# Altium project Motor_kontrol_Meta_Cekirdek.PrjPcb
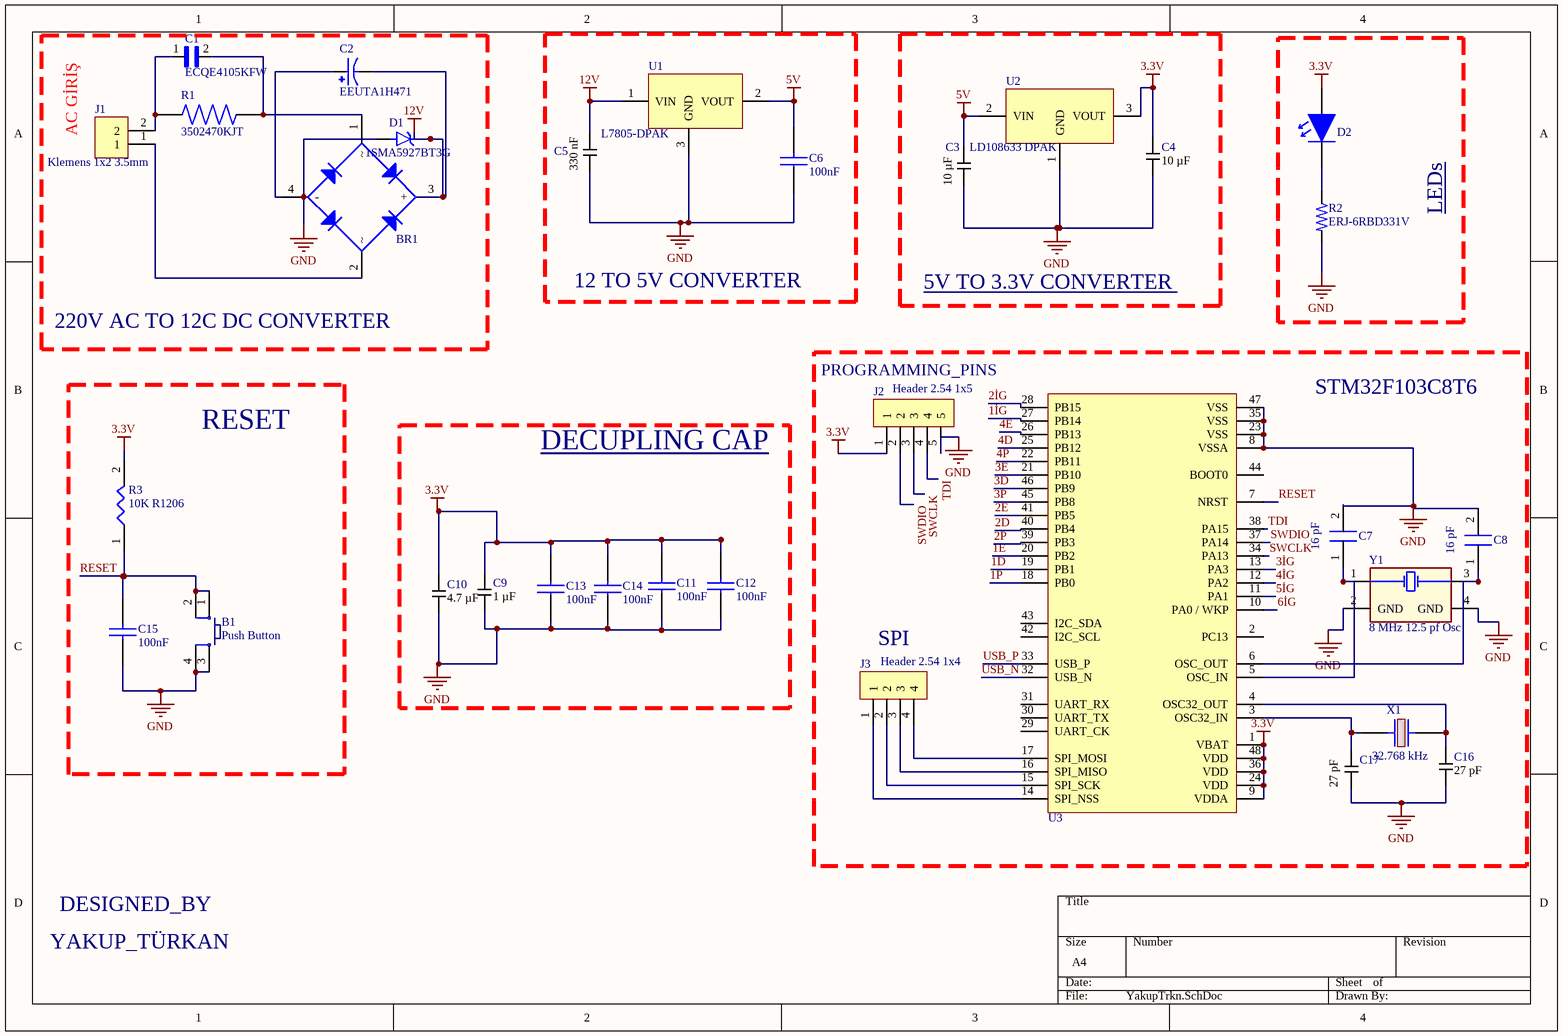
[diagram p0: YakupTrkn.SchDoc]
3 sheets, 70 parts. Net scope: global (net labels, ports and power ports of the same name join across sheets).
Board file: YakupTrkn.PcbDoc
Sheets:
  YakupTrkn.SchDoc
  YakupTrkn(block).SchDoc
  YakupTrkn1.SchDoc

## Sheet YakupTrkn.SchDoc
size A4

### Parts
B1  Push Button  [PUSB BUTTON-SMD]
BR1  DB105STR  [DB105STR]  (value not drawn)
C1  ECQE4105KFW  [CAPRR1500W80L2600T850H2300]
C2  EEUTA1H471  [CAPPRD750W80D1600H2000]
C3  Capacitance: 10 µF  [SAMSUNG_CAP_0805_140]  (hidden comment: CL21B106KPQNNNE)
C4  Capacitance: 10 µF  [SAMSUNG_CAP_0805_140]  (hidden comment: CL21B106KPQNNNE)
C5  Capacitance: 330 nF  [SAMSUNG_CAP_0805_095]  (hidden comment: CL21B334KOCNNNC)
C6  Capacitance: 100nF  [CAP_0603]  (hidden comment: C0603C104K5RACTU)
C7  16 pF  [C1206]
C8  16 pF  [C1206]
C9  Capacitance: 1 µF  [SAMSUNG_CAP_0805_135]  (hidden comment: CL21B105KBFNNNE)
C10  Capacitance: 4.7 µF  [SAMSUNG_CAP_0805_095]  (hidden comment: *)
C11  Capacitance: 100nF  [CAP_0603]  (hidden comment: C0603C104K5RACTU)
C12  Capacitance: 100nF  [CAP_0603]  (hidden comment: C0603C104K5RACTU)
C13  Capacitance: 100nF  [CAP_0603]  (hidden comment: C0603C104K5RACTU)
C14  Capacitance: 100nF  [CAP_0603]  (hidden comment: C0603C104K5RACTU)
C15  Capacitance: 100nF  [CAP_0603]  (hidden comment: C0603C104K5RACTU)
C16  Capacitance: 27 pF  [SAMSUNG_CAP_0805_075]  (hidden comment: CL21C270JBANNNC)
C17  Capacitance: 27 pF  [SAMSUNG_CAP_0805_075]  (hidden comment: CL21C270JBANNNC)
D1  1SMA5927BT3G  [DIOM5226X220N]
D2  LH R974-LP-1  [LED_RED_0805]  (value not drawn)
J1  Klemens 1x2 3.5mm  [Klemens 1x2 - 3.5mm]
J2  Header 2.54 1x5  [Header 2.54 1x5]
J3  Header 2.54 1x4  [Header 2.54 1x4]
R1  3502470KJT  [RESC5025X120N]
R2  ERJ-6RBD331V  [RESC2012X70]
R3  10K R1206  [R1206 Resıstor]
U1  L7805-DPAK  [DPAK228P972X230-3N]
U2  LD108633 DPAK  [DPAK228P972X230-3N]
U3  STM32F103C6T6A  [LQFP-48]  (value not drawn)
X1  Operating Frequency: 32.768 kHz  [ABS05]  (hidden comment: ABS05-32.768KHZ-T)
Y1  8 MHz 12.5 pf Osc  [8 MHZ Osc.]

### Nets
3.3V: C4.1 C9.2 C10.2 C11.2 C12.2 C13.2 C14.2 D2.2 J2.1 R3.2 U2.3(VOUT) U3.1(VBAT) U3.9(VDDA) U3.24(VDD) U3.36(VDD) U3.48(VDD)
5V: C3.2 C6.2 U1.2(VOUT) U2.2(VIN)
12V: BR1.3(+) C2.N C5.2 D1.C U1.1(VIN)
GND: B1.3 B1.4 C3.1 C4.2 C5.1 C6.1 C7.2 C8.2 C9.1 C10.1 C11.1 C12.1 C13.1 C14.1 C15.1 C16.1 C17.2 D1.A J2.5 R2.2 U1.3(GND) U2.1(GND) U3.8(VSSA) U3.23(VSS) U3.35(VSS) U3.47(VSS) Y1.2(GND) Y1.4(GND)
1D: U3.19(PB1)
1E: U3.20(PB2)
1İG: U3.27(PB14)
1P: U3.18(PB0)
2D: U3.40(PB4)
2E: U3.41(PB5)
2İG: U3.28(PB15)
2P: U3.39(PB3)
3D: U3.46(PB9)
3E: U3.21(PB10)
3İG: U3.13(PA3)
3P: U3.45(PB8)
4D: U3.25(PB12)
4E: U3.26(PB13)
4İG: U3.12(PA2)
4P: U3.22(PB11)
5İG: U3.11(PA1)
6İG: U3.10(PA0_/_WKP)
RESET: B1.1 B1.2 C15.2 R3.1 U3.7(NRST)
SWCLK: J2.3 U3.34(PA13)
SWDIO: J2.2 U3.37(PA14)
TDI: J2.4 U3.38(PA15)
USB_N: U3.32(USB_N)
USB_P: U3.33(USB_P)
NetBR1_1: BR1.1 C1.2 R1.2
NetBR1_2: BR1.2 J1.1
NetBR1_4: BR1.4(-) C2.P
NetC1_1: C1.1 J1.2 R1.1
NetC7_1: C7.1 U3.5(OSC_IN) Y1.1
NetC8_1: C8.1 U3.6(OSC_OUT) Y1.3
NetC16_2: C16.2 U3.4(OSC32_OUT) X1.2
NetC17_1: C17.1 U3.3(OSC32_IN) X1.1
NetD2_1: D2.1 R2.1
NetJ3_1: J3.1 U3.14(SPI_NSS)
NetJ3_2: J3.2 U3.15(SPI_SCK)
NetJ3_3: J3.3 U3.16(SPI_MISO)
NetJ3_4: J3.4 U3.17(SPI_MOSI)

Not connected (* = marked no-connect by the designer): U3 2(PC13) 29(UART_CK) 30(UART_TX) 31(UART_RX) 42(I2C_SCL) 43(I2C_SDA) 44(BOOT0)

### Notes on the sheet
- (near J1) AC GİRİŞ
- LEDs <leds>
- 12 TO 5V CONVERTER
- 5V TO 3.3V CONVERTER <5V TO 3.3V CONVERTER >
- 220V AC TO 12C DC CONVERTER
- (near J2) PROGRAMMING_PINS
- RESET
- STM32F103C8T6
- DECUPLING CAP
- (near J3) SPI
- DESIGNED_BY
- YAKUP_TÜRKAN

### Library data of the parts
B1 = Push Button: Smd Push Button; Satın Alma Linki: https://urun.n11.com/diger/mini-pushbutton-switch-smd-P227461537?gclid=Cj0KCQjwkoDmBRCcARIsAG3xzl8Y_-jeD7HocNM6lvuZ_rVp83568XPGtNzlPwXWLph8oCRqo0yh87UaApZYEALw_wcB&gclsrc=aw.ds
BR1 = DB105STR: Bridge Diode AC-DC; Manufacturer: Sangdest Microelectronics; Designed by: BERK; Max Current: 1A; Operating Voltage: 600V; Supplier 1: Digi-Key; Manufacturer Part Number: DB105STR; RoHS: No; Supplier Part Number 1: 1655-1821-1-ND
C1 = ECQE4105KFW: MF: {'manufacturer': u'Panasonic'}; MP: ECQE4105KFW; Price: None; Package: None; Value: *; Availability: Unavailable
C2 = EEUTA1H471: TA-A; MF: {'manufacturer': u'Panasonic'}; MP: EEUTA1H471; Price: None; Package: None; Value: *; Availability: Unavailable
C3 C4 = CL21B106KPQNNNE: CAP CER 10UF 10V X7R 0805; Supplier 1: Digi-Key; Supplier 2: Farnell; Supplier 3: Mouser; Supplier Part Number 1: 1276-1764-6-ND; Supplier Part Number 2: 3013487; Supplier Part Number 3: 187-CL21B106KPQNNNE
C5 = CL21B334KOCNNNC: CAP CER 0.33UF 16V X7R 0805; Supplier 1: Digi-Key; Supplier 2: Mouser; Supplier 3: Arrow Electronics; Supplier Part Number 1: 1276-1797-1-ND; Supplier Part Number 2: 187-CL21B334KOCNNNC; Supplier Part Number 3: CL21B334KOCNNNC
C6 C11-C15 = CAP CER 100nF 0603: CAP CER 100nF %10 0603 SMD; Manufacturer: KEMET; Designed by: BERK; Dielectric Material: Ceramic; Voltage Rating (DC): 50V; Tolerance: 10%; Dielectric: X7R; Dissipation Factor: 2.5%; Supplier 1: Digi-Key; Manufacturer Part Number: C0603C104K5RACTU; RoHS: Yes; Category: Ceramic Capacitors; Stock 1: 1666186; Pricing 1: 1=0,12000, 10=0,08500, 50=0,04620, 100=0,03770, 500=0,02696, 1000=0,02118 (USD); Mount: Surface Mount; Case/Package: 0603; Number of Pins: 2; Case Code (Metric): 1608; Case Code (Imperial): 0603; Contact Plating: Tin,Matte; Min Operating Temperature: -55°C; Max Operating Temperature: 125°C; Packaging: Tape and Reel; Package Quantity: 1; Termination: SMD/SMT; Voltage: 50V; Voltage Rating: 50V; Series: SMD Comm X7R; Length: 0.063inch; Width: 0.031inch; Height: 0.8mm; Thickness: 0.034inch; Lead Pitch: 0.7mm; Depth: 0.8mm; Radiation Hardening: No; RoHS Compliant: Yes; REACH SVHC: No SVHC; ComponentLink1URL: https://datasheet.ciiva.com/7823/kem-c1002-x7r-smd-7823591.pdf?src-supplier=Element14; ComponentLink1Description: https://datasheet.ciiva.com/7823/kem-c1002-x7r-smd-7823591.pdf?src-supplier=Element14; ComponentLink2URL: https://datasheet.ciiva.com/14602/70095383-14602583.pdf?src-supplier=Allied+Electronics; ComponentLink2Description: https://datasheet.ciiva.com/14602/70095383-14602583.pdf?src-supplier=Allied+Electronics; ComponentLink3URL: https://datasheet.ciiva.com/5999/kem-c1002-x7r-smd-5999400.pdf?src-supplier=Farnell; ComponentLink3Description: https://datasheet.ciiva.com/5999/kem-c1002-x7r-smd-5999400.pdf?src-supplier=Farnell; ComponentLink4URL: https://datasheet.ciiva.com/7823/kem-c1002-x7r-smd-7823592.pdf?src-supplier=Element14; ComponentLink4Description: https://datasheet.ciiva.com/7823/kem-c1002-x7r-smd-7823592.pdf?src-supplier=Element14; ComponentLink5URL: https://datasheet.ciiva.com/28645/1851736-28645640.pdf?src-supplier=Element14; ComponentLink5Description: https://datasheet.ciiva.com/28645/1851736-28645640.pdf?src-supplier=Element14; ComponentLink6URL: https://datasheet.ciiva.com/14585/70095383-14585209.pdf?src-supplier=Allied+Electronics; ComponentLink6Description: https://datasheet.ciiva.com/14585/70095383-14585209.pdf?src-supplier=Allied+Electronics; Supplier Part Number 1: 399-5089-1-ND
C9 = CL21B105KBFNNNE: CAP CER 1UF 50V X7R 0805; Supplier 1: Digi-Key; Supplier 2: Farnell; Supplier 3: Mouser; Supplier Part Number 1: 1276-1029-1-ND; Supplier Part Number 2: 3013482; Supplier Part Number 3: 187-CL21B105KBFNNNE
C10 = CL21A475KACLRNC: CAP CER 4.7UF 25V X5R 0805; Supplier 1: Digi-Key; Supplier 2: Mouser; Supplier 3: Arrow Electronics; Supplier Part Number 1: 1276-2415-1-ND; Supplier Part Number 2: 187-CL21A475KACLRNC; Supplier Part Number 3: CL21A475KACLRNC
C16 C17 = CL21C270JBANNNC: CAP CER 27PF 50V C0G/NP0 0805; Supplier 1: Digi-Key; Supplier Part Number 1: 1276-1285-1-ND
D1 = 1SMA5927BT3G: MF: {'manufacturer': u'ON Semiconductor'}; MP: 1SMA5927BT3G; Value: *; Availability: Unavailable; Package: None; Price: None
D2 = LED RED 0805: LED Uni-Color Hyper Red 660nm 2-Pin Chip 0805(2012Metric) T/R; Manufacturer: Osram Opto; Lens Color: White; Forward Voltage: 1.8V; Lens Style: Diffused,Flat,Colorless; Luminous Intensity: 71mcd; Viewing Angle: 160°; Forward Current: 30mA; Dominant Wavelength: 645nm; Number of Elements: 1; Test Current: 20mA; Reverse Voltage: 5V; Lens Transparency: Diffused; Luminous Flux: 0.17lm; Lens Size: 1.25mm; Designed by: BERK; Supplier 1: Digi-Key; Manufacturer Part Number: LH R974-LP-1; RoHS: Yes; Category: LEDs; Stock 1: 35632; Pricing 1: 1=0,26000, 10=0,13900, 100=0,06480, 500=0,05978, 1000=0,04683, 2000=0,04584 (USD); Mount: Surface Mount; Case/Package: 0805; Number of Pins: 2; Color: Red; Case Code (Imperial): 0805; Case Code (Metric): 2012; Min Operating Temperature: -30°C; Max Operating Temperature: 85°C; Packaging: Tape and Reel; Illumination Color: Red; Package Quantity: 1; Series: CHipLED; Length: 2.1mm; Width: 1.25mm; Depth: 1.35mm; Radiation Hardening: No; RoHS Compliant: Yes; ComponentLink1URL: http://www.jameco.com/Jameco/Products/ProdDS/2085634.pdf?src-supplier=Jameco; ComponentLink1Description: http://www.jameco.com/Jameco/Products/ProdDS/2085634.pdf?src-supplier=Jameco; ComponentLink2URL: http://components.arrow.com/part/dataview/0323_01825492?src-supplier=Arrow+Europe; ComponentLink2Description: http://components.arrow.com/part/dataview/0323_01825492?src-supplier=Arrow+Europe; ComponentLink3URL: https://dammedia.osram.info/media/resource/hires/osram-dam-2493888/LH%20R974.pdf?src-supplier=Digi-Key; ComponentLink3Description: https://dammedia.osram.info/media/resource/hires/osram-dam-2493888/LH%20R974.pdf?src-supplier=Digi-Key; ComponentLink4URL: http://www.mouser.com/ds/2/311/LH%20R974%20-%20CHIPLED%200805-318659.pdf?src-supplier=Mouser; ComponentLink4Description: http://www.mouser.com/ds/2/311/LH%20R974%20-%20CHIPLED%200805-318659.pdf?src-supplier=Mouser; ComponentLink5URL: https://www.verical.com/server-webapp/html/getDatasheet?partID=258950&src-supplier=Verical; ComponentLink5Description: https://www.verical.com/server-webapp/html/getDatasheet?partID=258950&src-supplier=Verical; ComponentLink6URL: http://components.arrow.com/part/dataview/41971690S1077610N9133?src-supplier=Arrow+Electronics; ComponentLink6Description: http://components.arrow.com/part/dataview/41971690S1077610N9133?src-supplier=Arrow+Electronics; ComponentLink7URL: http://components.arrow.com/part/dataview/41971690S6190115N2128?src-supplier=Arrow+Electronics; ComponentLink7Description: http://components.arrow.com/part/dataview/41971690S6190115N2128?src-supplier=Arrow+Electronics; Supplier Part Number 1: 475-1415-1-ND
R1 = 3502470KJT: MF: {'manufacturer': u'TE Connectivity'}; MP: 3502470KJT; Value: *; Availability: Unavailable; Package: None; Price: None
R2 = ERJ-6RBD331V: Thick Film Chip Res,0805, 0.5% Precision 330ohm, 5; MF: {'manufacturer': u'Panasonic'}; Price: None; MP: ERJ-6RBD331V; Value: *; Availability: Unavailable; Package: None
U1 = L7805-DPAK: L7805 5V REGULATOR. SMD PAKET
U2 = LD108633 DPAK: LD1086 3.3V REGULATOR
U3 = STM32F103C6T6A: MCU 32-bit STM32F ARM Cortex M3 RISC 32KB Flash 2.5V/3.3V 48-Pin LQFP Tray; Manufacturer: STMicroelectronics; Number of Timers/Counters: 3; Max Supply Voltage: 3.6V; Frequency: 72MHz; Interface: I2C,SPI,USART; RAM Size: 10KB; Max Power Dissipation: 363mW; Number of I/Os: 37; Min Supply Voltage: 2V; Oscillator Type: Internal; Data Bus Width: 32b; Watchdog Timer: Yes; Peripherals: POR,PWM,WDT,DMA,Temp Sensor,I2C; Number of ADC Channels: 10; Number of SPI Channels: 1; Designed by: BERK; SleepMode: OK; Supplier 1: Digi-Key; Manufacturer Part Number: STM32F103C6T6A; RoHS: Yes; Category: Microcontrollers; Stock 1: 30; Pricing 1: 1=5,07000, 10=4,55000, 25=4,30120, 80=3,72763, 250=3,53648, 500=3,18600 (USD); Case/Package: LQFP; Number of Pins: 48; Weight: 0.006409oz; Min Operating Temperature: -40°C; Max Operating Temperature: 85°C; Package Quantity: 1500; Packaging: Tray; Max Frequency: 72MHz; Number of Programmable I/O: 37; Memory Type: FLASH; Memory Size: 32KB; Core Architecture: ARM; Series: STM32F103C6; Number of I2C Channels: 1; Address Bus Width: 32b; Length: 7mm; Width: 7mm; Height: 1.4mm; Radiation Hardening: No; Lead Free: Lead Free; REACH SVHC: No SVHC; RoHS Compliant: Yes; ComponentLink1URL: https://datasheet.ciiva.com/15122/getdatasheetpartid-69879-15122075.pdf?src-supplier=Verical; ComponentLink1Description: https://datasheet.ciiva.com/15122/getdatasheetpartid-69879-15122075.pdf?src-supplier=Verical; ComponentLink2URL: https://datasheet.ciiva.com/14100/pustm-arm-microcont-stm32f103-en-14100507.pdf?src-supplier=Distrelec; ComponentLink2Description: https://datasheet.ciiva.com/14100/pustm-arm-microcont-stm32f103-en-14100507.pdf?src-supplier=Distrelec; Supplier 2: Avnet; Stock 2: 2360; Pricing 2: 250=1,99138, 260=1,95951, 510=1,91172, 1300=1,87986, 2500=1,84800, 13000=1,81613, 25000=1,78427 (USD); Supplier Part Number 1: 497-11515-ND; Supplier Part Number 2: STM32F103C6T6A
X1 = CRYSTAL 32768kHZ_1: Crystal, 32.768 kHz, SMD, 1.6mm x 1mm, 12.5 pF, 20 ppm, ABS05 Series; Manufacturer: Abracon; Frequency Tolerance: 20ppm; Load Capacitance: 12.5pF; ESR (Equivalent Series Resistance): 90kR; Designed by: BERK; Supplier 1: Digi-Key; Manufacturer Part Number: ABS05-32.768KHZ-T; RoHS: Yes; Category: Crystals; Stock 1: 180522; Pricing 1: 1=1,16000, 10=1,02500, 50=0,95760, 100=0,84630, 500=0,80180, 1000=0,66816 (USD); Mount: Surface Mount; Case/Package: SMD/SMT; Number of Pins: 2; Min Operating Temperature: -40°C; Max Operating Temperature: 85°C; Packaging: Tape and Reel; Package Quantity: 3000; Frequency: 32.768kHz; Tolerance: 20ppm; Termination: SMD/SMT; Series Resistance: 90kR; Series: ABS05; Length: 1.6mm; Width: 0.039inch; Height: 0.02inch; Depth: 1mm; Radiation Hardening: No; REACH SVHC: No SVHC; Lead Free: Lead Free; RoHS Compliant: Yes; ComponentLink1URL: https://datasheet.ciiva.com/23810/abs05-23810480.pdf?src-supplier=Newark; ComponentLink1Description: https://datasheet.ciiva.com/23810/abs05-23810480.pdf?src-supplier=Newark; ComponentLink2URL: https://datasheet.ciiva.com/6728/abs05-6728949.pdf?src-supplier=Digi-Key; ComponentLink2Description: https://datasheet.ciiva.com/6728/abs05-6728949.pdf?src-supplier=Digi-Key; ComponentLink3URL: https://datasheet.ciiva.com/6728/abs05-6728950.pdf?src-supplier=Digi-Key; ComponentLink3Description: https://datasheet.ciiva.com/6728/abs05-6728950.pdf?src-supplier=Digi-Key; ComponentLink4URL: https://datasheet.ciiva.com/16411/abs05-16411149.pdf?src-supplier=Future+Electronics; ComponentLink4Description: https://datasheet.ciiva.com/16411/abs05-16411149.pdf?src-supplier=Future+Electronics; Supplier Part Number 1: 535-11899-1-ND

## Sheet YakupTrkn(block).SchDoc
size A4
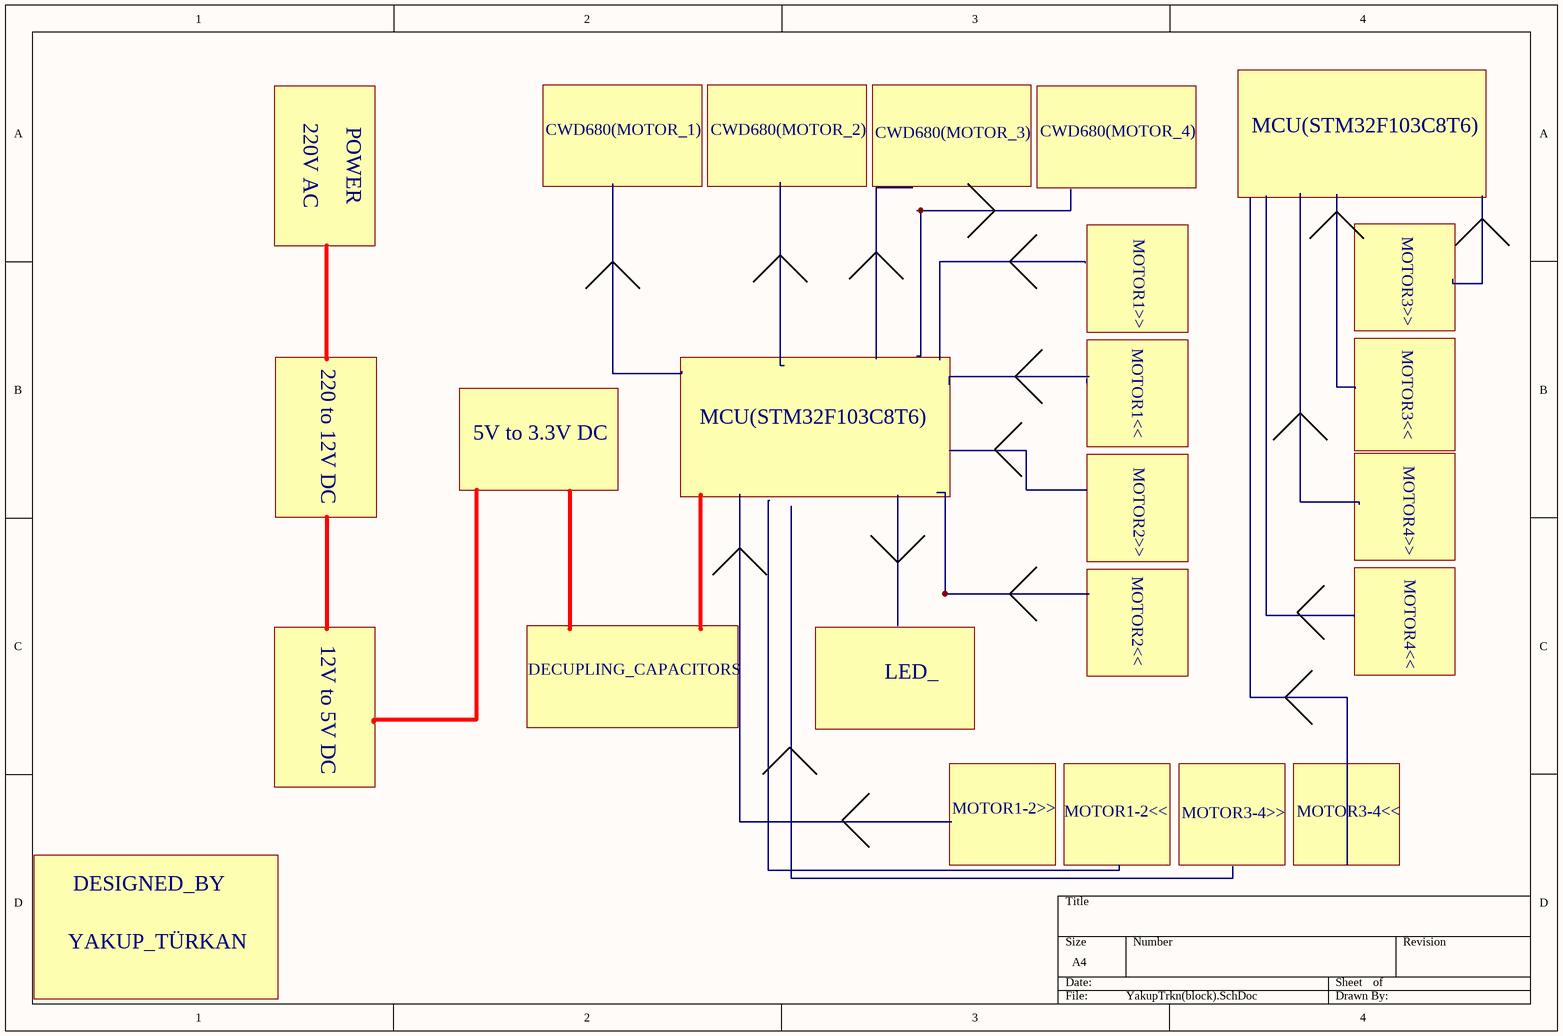
[diagram p1: YakupTrkn(block).SchDoc]

### Notes on the sheet
- 220V AC
- POWER
- CWD680(MOTOR_1)
- CWD680(MOTOR_2)
- CWD680(MOTOR_3)
- CWD680(MOTOR_4)
- MCU(STM32F103C8T6)
- MOTOR1>>
- MOTOR3>>
- 220 to 12V DC
- MOTOR1<<
- MOTOR3<<
- 5V to 3.3V DC
- MOTOR2>>
- MOTOR4>>
- MOTOR2<<
- MOTOR4<<
- 12V to 5V DC
- DECUPLING_CAPACITORS
- LED_
- MOTOR1-2>>
- MOTOR1-2<<
- MOTOR3-4>>
- MOTOR3-4<<
- DESIGNED_BY
- YAKUP_TÜRKAN

## Sheet YakupTrkn1.SchDoc
size A4
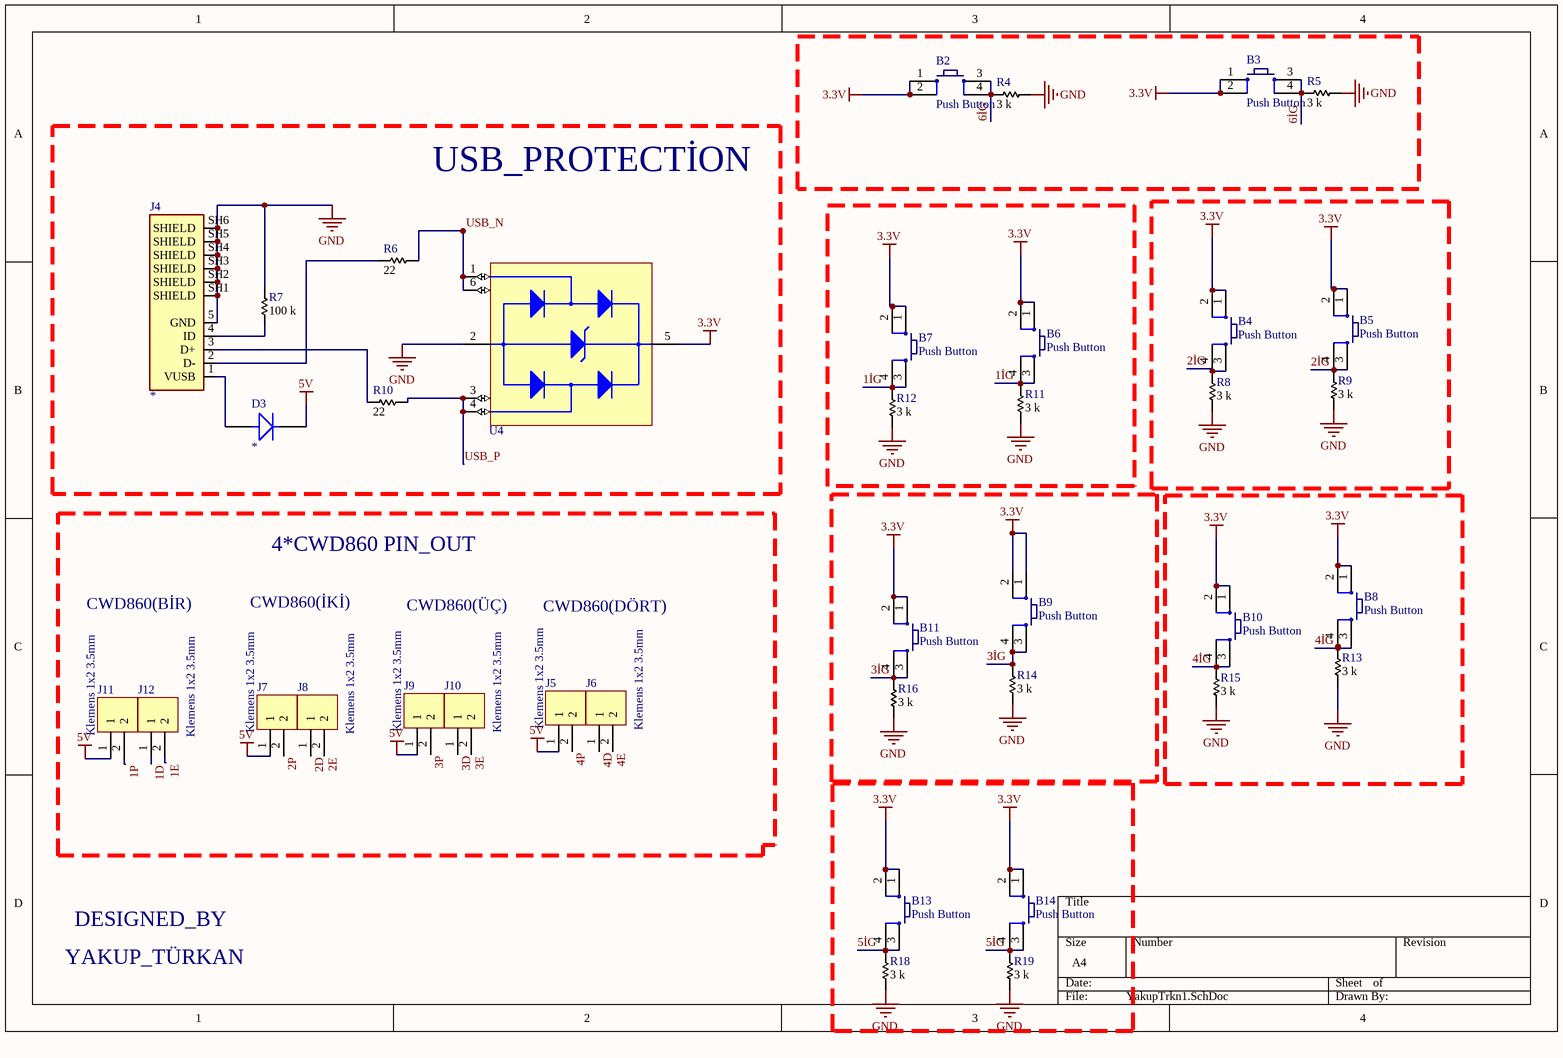
[diagram p2: YakupTrkn1.SchDoc]

### Parts
B2  Push Button  [PUSB BUTTON-SMD]
B3  Push Button  [PUSB BUTTON-SMD]
B4  Push Button  [PUSB BUTTON-SMD]
B5  Push Button  [PUSB BUTTON-SMD]
B6  Push Button  [PUSB BUTTON-SMD]
B7  Push Button  [PUSB BUTTON-SMD]
B8  Push Button  [PUSB BUTTON-SMD]
B9  Push Button  [PUSB BUTTON-SMD]
B10  Push Button  [PUSB BUTTON-SMD]
B11  Push Button  [PUSB BUTTON-SMD]
B13  Push Button  [PUSB BUTTON-SMD]
B14  Push Button  [PUSB BUTTON-SMD]
D3  *  [DIOM5226X220N]
J4  *  [AMPHENOL_10118192-0001LF]
J5  Klemens 1x2 3.5mm  [Klemens 1x2 - 3.5mm]
J6  Klemens 1x2 3.5mm  [Klemens 1x2 - 3.5mm]
J7  Klemens 1x2 3.5mm  [Klemens 1x2 - 3.5mm]
J8  Klemens 1x2 3.5mm  [Klemens 1x2 - 3.5mm]
J9  Klemens 1x2 3.5mm  [Klemens 1x2 - 3.5mm]
J10  Klemens 1x2 3.5mm  [Klemens 1x2 - 3.5mm]
J11  Klemens 1x2 3.5mm  [Klemens 1x2 - 3.5mm]
J12  Klemens 1x2 3.5mm  [Klemens 1x2 - 3.5mm]
R4  Resistance: 3 k  [ROYALOHM_RES_0805]  (hidden comment: 0805S8F3001T5E)
R5  Resistance: 3 k  [ROYALOHM_RES_0805]  (hidden comment: 0805S8F3001T5E)
R6  Resistance: 22  [ROYALOHM_RES_0805]  (hidden comment: 0805W8J0220T5E)
R7  Resistance: 100 k  [ROYALOHM_RES_0603]  (hidden comment: 0603SAJ0104T5E)
R8  Resistance: 3 k  [ROYALOHM_RES_0805]  (hidden comment: 0805S8F3001T5E)
R9  Resistance: 3 k  [ROYALOHM_RES_0805]  (hidden comment: 0805S8F3001T5E)
R10  Resistance: 22  [ROYALOHM_RES_0805]  (hidden comment: 0805W8J0220T5E)
R11  Resistance: 3 k  [ROYALOHM_RES_0805]  (hidden comment: 0805S8F3001T5E)
R12  Resistance: 3 k  [ROYALOHM_RES_0805]  (hidden comment: 0805S8F3001T5E)
R13  Resistance: 3 k  [ROYALOHM_RES_0805]  (hidden comment: 0805S8F3001T5E)
R14  Resistance: 3 k  [ROYALOHM_RES_0805]  (hidden comment: 0805S8F3001T5E)
R15  Resistance: 3 k  [ROYALOHM_RES_0805]  (hidden comment: 0805S8F3001T5E)
R16  Resistance: 3 k  [ROYALOHM_RES_0805]  (hidden comment: 0805S8F3001T5E)
R18  Resistance: 3 k  [ROYALOHM_RES_0805]  (hidden comment: 0805S8F3001T5E)
R19  Resistance: 3 k  [ROYALOHM_RES_0805]  (hidden comment: 0805S8F3001T5E)
U4  USBLC6-2SC6  [SOT23-6L]  (value not drawn)

### Nets
3.3V: B2.1 B2.2 B3.1 B3.2 B4.1 B4.2 B5.1 B5.2 B6.1 B6.2 B7.1 B7.2 B8.1 B8.2 B9.1 B9.2 B10.1 B10.2 B11.1 B11.2 B13.1 B13.2 B14.1 B14.2 U4.5(VBUS)
5V: D3.1(K) J5.1 J7.1 J9.1 J11.1
GND: J4.5(GND) J4.SH1(SHIELD) J4.SH2(SHIELD) J4.SH3(SHIELD) J4.SH4(SHIELD) J4.SH5(SHIELD) J4.SH6(SHIELD) R4.1 R5.1 R7.2 R8.1 R9.1 R11.1 R12.1 R13.1 R14.1 R15.1 R16.1 R18.1 R19.1 U4.2(GND)
1D: J12.1
1E: J12.2
1İG: B6.3 B6.4 B7.3 B7.4 R11.2 R12.2
1P: J11.2
2D: J8.1
2E: J8.2
2İG: B4.3 B4.4 B5.3 B5.4 R8.2 R9.2
2P: J7.2
3D: J10.1
3E: J10.2
3İG: B9.3 B9.4 B11.3 B11.4 R14.2 R16.2
3P: J9.2
4D: J6.1
4E: J6.2
4İG: B8.3 B8.4 B10.3 B10.4 R13.2 R15.2
4P: J5.2
5İG: B13.3 B13.4 B14.3 B14.4 R18.2 R19.2
6İG: B2.3 B2.4 B3.3 B3.4 R4.2 R5.2
USB_N: R6.2 U4.1(I/O1) U4.6(I/O1)
USB_P: R10.2 U4.3(I/O2) U4.4(I/O2)
NetD3_2: D3.2(A) J4.1(VUSB)
NetJ4_2: J4.2(D-) R6.1
NetJ4_3: J4.3(D+) R10.1
NetJ4_4: J4.4(ID) R7.1

### Notes on the sheet
- USB_PROTECTİON
- 4*CWD860 PIN_OUT
- CWD860(BİR)
- CWD860(İKİ)
- CWD860(ÜÇ)
- CWD860(DÖRT)
- YAKUP_TÜRKAN
- DESIGNED_BY

### Library data of the parts
B2-B11 B13 B14 = Push Button: Smd Push Button; Satın Alma Linki: https://urun.n11.com/diger/mini-pushbutton-switch-smd-P227461537?gclid=Cj0KCQjwkoDmBRCcARIsAG3xzl8Y_-jeD7HocNM6lvuZ_rVp83568XPGtNzlPwXWLph8oCRqo0yh87UaApZYEALw_wcB&gclsrc=aw.ds
D3 = MBRA210LT3G: ...employing the Schottky Barrier principle in a metal to silicon power rectifier.; MF: {'manufacturer': u'ON Semiconductor'}; Price: None; Availability: Unavailable; MP: MBRA210LT3G; Value: *; Package: None
J4 = 10118192-0001LF: Single Port 5 Contact Horizontal Right Angle Shielded Micro B USB 2.0 Connector; MF: {'manufacturer': u'FCI'}; Package: None; Availability: Unavailable; Value: *; MP: 10118192-0001LF; Price: None
R4 R5 R8 R9 R11-R16 R18 R19 = 0805S8F3001T5E: RES SMD 3K OHM 1% 1/8W 0805
R6 R10 = 0805W8J0220T5E: RES SMD 22 OHM 5% 1/8W 0805
R7 = 0603SAJ0104T5E: RES SMD 100K OHM 5% 1/10W 0603
U4 = USB PROTECTION: TVS DIODE 5.25V 17V SOT23-6; Manufacturer: STMicroelectronics; Designed by: BERK; Direction: Unidirectional,Bidirectional; Capacitance: 3.5pF; Operating Supply Voltage: 1.1V; Number of Channels: 2; Breakdown Voltage: 6V; Power Line Protection: Yes; Test Current: 1mA; Max Reverse Leakage Current: 150nA; Peak Pulse Current: 5A; Element Configuration: Dual; Data Rate: 480Mbps; Number of Elements: 1; Working Voltage: 5V; Supplier 1: Digi-Key; Manufacturer Part Number: USBLC6-2SC6; RoHS: Yes; Category: TVS Diodes; Stock 1: 112981; Pricing 1: 1=0,50000, 10=0,43100, 100=0,29930, 500=0,23368, 1000=0,19005 (USD); Mount: Surface Mount; Case/Package: SOT-23; Number of Pins: 6; Contact Plating: Tin,Matte; Min Operating Temperature: -40°C; Max Operating Temperature: 125°C; Clamping Voltage: 17V; Packaging: Tape and Reel; Package Quantity: 3000; Termination: SMD/SMT; Number of Bidirectional Channels: 2; Reverse Standoff Voltage: 5.25V; Min Breakdown Voltage: 6V; ESD Protection: Yes; Leakage Current: 150nA; Series: USB; Reverse Breakdown Voltage: 6V; Polarity: Unidirectional,Bidirectional; Max Breakdown Voltage: 6V; Clamping Voltage-Max: 17V; Length: 3.05mm; Width: 1.75mm; Height: 1.3mm; Depth: 1.75mm; Radiation Hardening: No; REACH SVHC: No SVHC; Lead Free: Lead Free; RoHS Compliant: Yes; ComponentLink1URL: https://datasheet.ciiva.com/1268/1690354-1268384.pdf?src-supplier=Element14; ComponentLink1Description: https://datasheet.ciiva.com/1268/1690354-1268384.pdf?src-supplier=Element14; ComponentLink2URL: https://datasheet.ciiva.com/4508/cd00050750-113117-4508433.pdf?src-supplier=Mouser; ComponentLink2Description: https://datasheet.ciiva.com/4508/cd00050750-113117-4508433.pdf?src-supplier=Mouser; ComponentLink3URL: https://datasheet.ciiva.com/15143/getdatasheetpartid-148465-15143789.pdf?src-supplier=Verical; ComponentLink3Description: https://datasheet.ciiva.com/15143/getdatasheetpartid-148465-15143789.pdf?src-supplier=Verical; ComponentLink4URL: https://datasheet.ciiva.com/26787/usblc6-2sc6-26787908.pdf?src-supplier=IIIC; ComponentLink4Description: https://datasheet.ciiva.com/26787/usblc6-2sc6-26787908.pdf?src-supplier=IIIC; ComponentLink5URL: https://datasheet.ciiva.com/16200/cd00050750-16200026.pdf?src-supplier=Future+Electronics; ComponentLink5Description: https://datasheet.ciiva.com/16200/cd00050750-16200026.pdf?src-supplier=Future+Electronics; ComponentLink6URL: https://datasheet.ciiva.com/41444/001184109-da-01-en-ic-esd-protecti-usblc6-2sc6-sot-23-6-stm-41444156.pdf?src-supplier=Conrad; ComponentLink6Description: https://datasheet.ciiva.com/41444/001184109-da-01-en-ic-esd-protecti-usblc6-2sc6-sot-23-6-stm-41444156.pdf?src-supplier=Conrad; Supplier Part Number 1: 497-5235-1-ND

## Nets that join several sheets
3.3V: YakupTrkn (16 pins), YakupTrkn1 (25 pins)
5V: YakupTrkn (C3.2 C6.2 U1.2 U2.2), YakupTrkn1 (5 pins)
GND: YakupTrkn (28 pins), YakupTrkn1 (21 pins)
1D: YakupTrkn (U3.19), YakupTrkn1 (J12.1)
1E: YakupTrkn (U3.20), YakupTrkn1 (J12.2)
1İG: YakupTrkn (U3.27), YakupTrkn1 (6 pins)
1P: YakupTrkn (U3.18), YakupTrkn1 (J11.2)
2D: YakupTrkn (U3.40), YakupTrkn1 (J8.1)
2E: YakupTrkn (U3.41), YakupTrkn1 (J8.2)
2İG: YakupTrkn (U3.28), YakupTrkn1 (6 pins)
2P: YakupTrkn (U3.39), YakupTrkn1 (J7.2)
3D: YakupTrkn (U3.46), YakupTrkn1 (J10.1)
3E: YakupTrkn (U3.21), YakupTrkn1 (J10.2)
3İG: YakupTrkn (U3.13), YakupTrkn1 (6 pins)
3P: YakupTrkn (U3.45), YakupTrkn1 (J9.2)
4D: YakupTrkn (U3.25), YakupTrkn1 (J6.1)
4E: YakupTrkn (U3.26), YakupTrkn1 (J6.2)
4İG: YakupTrkn (U3.12), YakupTrkn1 (6 pins)
4P: YakupTrkn (U3.22), YakupTrkn1 (J5.2)
5İG: YakupTrkn (U3.11), YakupTrkn1 (6 pins)
6İG: YakupTrkn (U3.10), YakupTrkn1 (6 pins)
USB_N: YakupTrkn (U3.32), YakupTrkn1 (R6.2 U4.1 U4.6)
USB_P: YakupTrkn (U3.33), YakupTrkn1 (R10.2 U4.3 U4.4)